# EAGLE schematic doorbell (EAGLE 7.2.0)
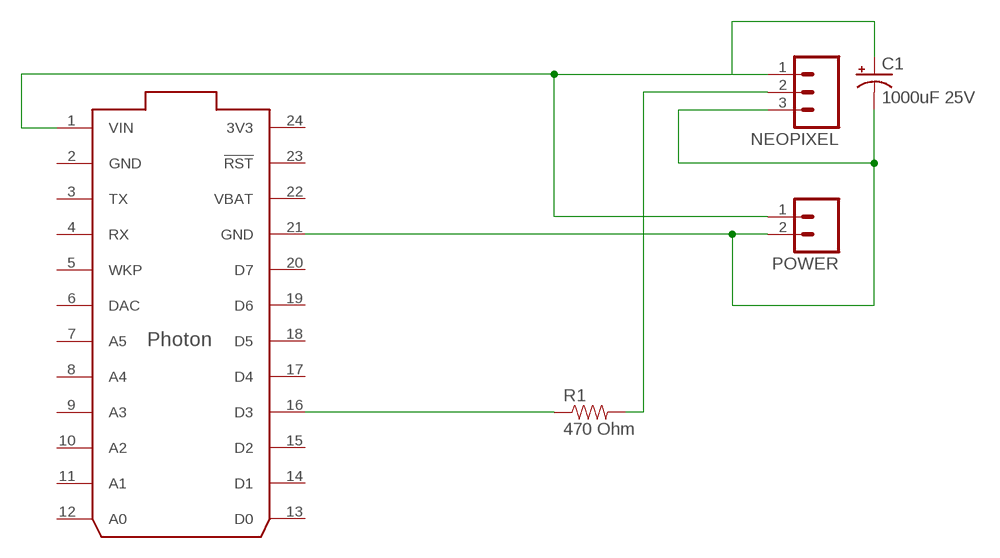
[diagram p0: schematic, sheet 1]

## Parts
C1  1000uF 25V  1000UF-25V(PTH)  [CPOL-RADIAL-1000UF-25V]
NEOPIXEL  M03LONGPADS  [1X03_LONGPADS]
POWER  M02POGO_PIN_HOLES_ONLY  [1X02_PP_HOLES_ONLY]
R1  470 Ohm  RESISTORAXIAL-0.3  [AXIAL-0.3]
U$1  PHOTON_SMD  [PHOTON_SMD]

## Nets
N$1: C1.- NEOPIXEL.3 POWER.2 U$1.21(GND)
N$2: NEOPIXEL.2 R1.P$2
N$4: R1.P$1 U$1.16(D3)
N$5: C1.+ NEOPIXEL.1 POWER.1 U$1.1(VIN)
Unconnected: U$1.3(TX) U$1.4(RX) U$1.5(WKP) U$1.6(DAC) U$1.7(A5) U$1.8(A4) U$1.9(A3) U$1.10(A2) U$1.11(A1) U$1.12(A0) U$1.13(D0) U$1.14(D1) U$1.15(D2) U$1.17(D4) U$1.18(D5) U$1.19(D6) U$1.20(D7) U$1.23(!RST) U$1.25(EN) U$1.26(!SETUP) U$1.27(RGB_RED) U$1.28(RGB_GREEN) U$1.29(RGB_BLUE) U$1.30(USB_D-) U$1.31(USB_D+)

## Power pins joined to a net without a drawn wire
3V3: U$1.24(3V3)
GND: U$1.2(GND)
VBAT: U$1.22(VBAT)

## Library data of the parts
C1 = SparkFun-Capacitors:1000UF-25V(PTH): CAP-08070; PROD_ID: CAP-09538; VALUE: CAP-09538
NEOPIXEL = SparkFun-Connectors:M03: Header 3 Standard 3-pin 0.1" header. Use with straight break away headers (SKU : PRT-00116), right angle break away headers (PRT-00553), swiss pins (PRT-00743), machine pins (PRT-00117), and female headers (PRT-00115). Molex polarized connector foot print use with SKU : PRT-08232 with associated crimp pins and housings.
POWER = SparkFun-Connectors:M02: Standard 2-pin 0.1" header. Use with - straight break away headers ( PRT-00116) - right angle break away headers (PRT-00553) - swiss pins (PRT-00743) - machine pins (PRT-00117) - female headers (PRT-00115) Molex polarized connector foot print use with: PRT-08233 with associated crimp pins and housings. 2.54_SCREWTERM for use with PRT-10571. 3.5mm Screw Terminal footprints for PRT-08084 5mm Screw Terminal footprints for use with PRT-08432
R1 = SparkFun-Passives:RESISTOR: Resistor Basic schematic elements and footprints for 0603, 1206, and PTH resistors.
U$1 = Spark:PHOTON_SMD: Photon (without headers) - designed to be surface mounted with 7 extra exposed pads on the bottom of the board which include, 3 RGB LED outputs, /SETUP, EN (3.3V SMPS enable input), USB D+ and USB D-.